# Altium schematic sheet Transformer_Powder.SchDoc
size A4
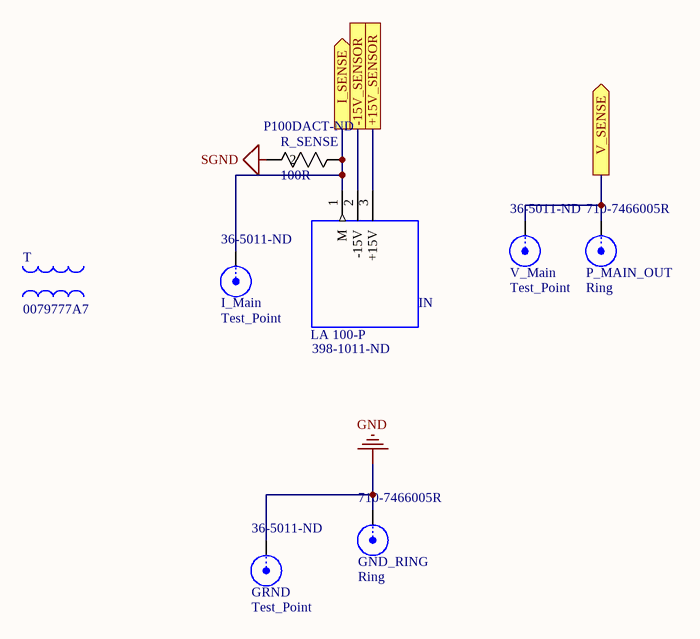
[diagram p0: Transformer_Powder.SchDoc]

## Parts
GND_RING  Ring  Supplier Part Number 1: 710-7466005R  [7466005R]
GRND  Test_Point  Supplier Part Number 1: 36-5011-ND  [5011]
I_Main  Test_Point  Supplier Part Number 1: 36-5011-ND  [5011]
LA_100-P  IN  Supplier Part Number 1: 398-1011-ND  [LA 100-P]
P_MAIN_OUT  Ring  Supplier Part Number 1: 710-7466005R  [7466005R]
R_SENSE  100R  Supplier Part Number 1: P100DACT-ND  [RES_ERA6A_0805]
T  0079777A7  [Fat_Man]
V_Main  Test_Point  Supplier Part Number 1: 36-5011-ND  [5011]

## Ports
+15V_SENSOR, -15V_SENSOR, I_SENSE (out), V_SENSE (out)

## Nets
GND: GND_RING.1(X) GRND.1(X)
SGND: R_SENSE.2
+15V_SENSOR: LA_100-P.3(+15V) ; port +15V_SENSOR
-15V_SENSOR: LA_100-P.2(-15V) ; port -15V_SENSOR
I_SENSE: I_Main.1(X) LA_100-P.1(M) R_SENSE.1 ; port I_SENSE
V_SENSE: P_MAIN_OUT.1(X) V_Main.1(X) ; port V_SENSE

## Library data of the parts
GND_RING P_MAIN_OUT = BNC: Ring Connector; Manufacturer: Wurth Electronics; Current Rating: 70A; Thread Size: M5; ComponentLink1URL: https://katalog.we-online.de/em/datasheet/7466003.pdf?src-supplier=Digi-Key; ComponentLink1Description: https://katalog.we-online.de/em/datasheet/7466003.pdf?src-supplier=Digi-Key; Supplier 1: Mouser; Manufacturer Part Number: 7466005R; Stock 1: 2328; Pricing 1: 1=2.37, 10=1.98, 25=1.98, 50=1.74, 100=1.58, 250=1.58 (USD); Mount: Surface Mount; Contact Plating: Tin; Contact Material: Brass; Termination: Power; ComponentLink2URL: https://katalog.we-online.de/em/datasheet/7466005R.pdf?src-supplier=Digi-Key; ComponentLink2Description: https://katalog.we-online.de/em/datasheet/7466005R.pdf?src-supplier=Digi-Key
GRND I_Main V_Main = BNC: Manufacturer: Keystone Electronics; Body Material: PBT; Gender: Female; Number of Ports: 1; Inside Diameter: 1.78mm; Hole Diameter: 1.6mm; Supplier 1: Digi-Key; Manufacturer Part Number: 5011; Stock 1: 84156; Pricing 1: 1=0.35, 25=0.308, 100=0.3015, 250=0.28304, 500=0.2523, 1000=0.1714, 2500=0.15296, 5000=0.1434, 10000=0.13384 (USD); Mount: PCB,Through Hole; Color: Black; Contact Material: Bronze; Contact Plating: Silver,Tin; Material: Nylon,Bronze,Silver; Housing Color: Black; Package Quantity: 100; Packaging: Bulk; Orientation: Straight; Length: 11.3mm; Lead Free: Lead Free; REACH SVHC: No SVHC; Flammability Rating: UL94 V-0; ComponentLink1URL: http://www.farnell.com/datasheets/1703983.pdf?src-supplier=Element14; ComponentLink1Description: http://www.farnell.com/datasheets/1703983.pdf?src-supplier=Element14; ComponentLink2URL: http://www.keyelco.com/product-pdf.cfm?p=1320&src-supplier=Digi-Key; ComponentLink2Description: http://www.keyelco.com/product-pdf.cfm?p=1320&src-supplier=Digi-Key; ComponentLink3URL: http://www.keyelco.com/userAssets/file/M60-2p60.pdf?src-supplier=Future+Electronics; ComponentLink3Description: http://www.keyelco.com/userAssets/file/M60-2p60.pdf?src-supplier=Future+Electronics; ComponentLink4URL: http://uk.rs-online.com/webdocs/1416/0900766b814167b6.pdf?src-supplier=RSComponents; ComponentLink4Description: http://uk.rs-online.com/webdocs/1416/0900766b814167b6.pdf?src-supplier=RSComponents
LA_100-P = LKSR_6-NP: Current Transducer LA series; Manufacturer: LEM; Manufacturer Part Number: LA100-P; Operating Supply Voltage: 15V; Response Time: 1us; Accuracy: 0.45%; Current Rating: 100A; Secondary Current: 50mA; Frequency: 200kHz; Number of Channels: 1; Max Supply Current: 10mA; Polarity: Bidirectional; Min Supply Voltage (DC): 12V; Linearity: 0.15%; Wire/Cable Diameter: 7mm; Supplier 1: Digi-Key; Stock 1: 1997; Pricing 1: 1=25.57, 5=24.402, 10=22.079, 25=20.336, 50=18.0118, 100=17.4307, 500=16.26864 (USD); Mount: Through Hole,PCB; Case/Package: 100; Min Operating Temperature: -40°C; Max Operating Temperature: 85°C; Package Quantity: 1; Packaging: Bulk; Max Supply Voltage (DC): 15V; Current Sensing: 100A; Height: 27.2mm; Width: 36.5mm; Lead Free: Lead Free; REACH SVHC: No SVHC; ComponentLink1URL: https://www.distrelec.biz/Web/Downloads/_t/ds/LA100P_eng_tds.pdf?mime=application%2Fpdf&src-supplier=Distrelec; ComponentLink1Description: https://www.distrelec.biz/Web/Downloads/_t/ds/LA100P_eng_tds.pdf?mime=application%2Fpdf&src-supplier=Distrelec; ComponentLink2URL: http://www.farnell.com/datasheets/1639874.pdf?src-supplier=Element14; ComponentLink2Description: http://www.farnell.com/datasheets/1639874.pdf?src-supplier=Element14; ComponentLink3URL: https://www.lem.com/sites/default/files/products_datasheets/la_100-p_e_.pdf?src-supplier=Digi-Key; ComponentLink3Description: https://www.lem.com/sites/default/files/products_datasheets/la_100-p_e_.pdf?src-supplier=Digi-Key; ComponentLink4URL: http://datasheet.iiic.cc/lem/LA100-P.pdf?src-supplier=IIIC; ComponentLink4Description: http://datasheet.iiic.cc/lem/LA100-P.pdf?src-supplier=IIIC
R_SENSE = ERA6AEB101V: No Description Available; Manufacturer Part Number: ERA-6AEB101V; Vendor: Panasonic; Built_By: EMA_UL_Team; Tolerance: 0.1%; Temperature Coefficient: 25ppm/°C; Power Rating: 125mW; Voltage Rating: 100V; Manufacturer_Part_Number: ERA6AEB101V; Copyright: Copyright (C) 2018 Accelerated Designs. All rights reserved; RefDes: RefDes; Type: DEV; Value: Value; Supplier 1: Digi-Key; Manufacturer: Panasonic; Stock 1: 138980; Pricing 1: 1=0.36, 10=0.302, 100=0.1182, 1000=0.04948, 2500=0.04536 (USD); Mount: Surface Mount; Case/Package: 0805; Number of Pins: 2; Contact Plating: Tin; Case Code (Imperial): 0805; Case Code (Metric): 2012; Min Operating Temperature: -55°C; Max Operating Temperature: 155°C; Resistance: 100R; Composition: Metal Film,Thin Film; Packaging: Tape and Reel; Package Quantity: 1; Termination: SMD/SMT; Number of Terminations: 2; Military Standard: Not; Max Power Dissipation: 125mW; Voltage Rating (DC): 100V; Features: Automotive AEC-Q200; Length: 2mm; Height: 0.5mm; Width: 1.25mm; Depth: 1.25mm; Radiation Hardening: No; REACH SVHC: No SVHC; Lead Free: Lead Free; ComponentLink1URL: https://www.alliedelec.com/m/d/b6b0537e86f421aa7f5975bb1d8f429a.pdf?src-supplier=Allied+Electronics; ComponentLink1Description: https://www.alliedelec.com/m/d/b6b0537e86f421aa7f5975bb1d8f429a.pdf?src-supplier=Allied+Electronics; ComponentLink2URL: http://www.farnell.com/datasheets/485442.pdf?src-supplier=Farnell; ComponentLink2Description: http://www.farnell.com/datasheets/485442.pdf?src-supplier=Farnell; ComponentLink3URL: http://www.farnell.com/datasheets/485442.pdf?src-supplier=Element14; ComponentLink3Description: http://www.farnell.com/datasheets/485442.pdf?src-supplier=Element14; ComponentLink4URL: http://industrial.panasonic.com/www-data/pdf/AOA0000/AOA0000CE26.pdf?src-supplier=Avnet+Europe; ComponentLink4Description: http://industrial.panasonic.com/www-data/pdf/AOA0000/AOA0000CE26.pdf?src-supplier=Avnet+Europe; ComponentLink5URL: http://www.mouser.com/ds/2/315/AOA0000CE26-32660.pdf?src-supplier=Mouser; ComponentLink5Description: http://www.mouser.com/ds/2/315/AOA0000CE26-32660.pdf?src-supplier=Mouser; ComponentLink6URL: https://www.distrelec.biz/Web/Downloads/_t/ds/ERA_eng_tds.pdf?mime=application%2Fpdf&src-supplier=Distrelec; ComponentLink6Description: https://www.distrelec.biz/Web/Downloads/_t/ds/ERA_eng_tds.pdf?mime=application%2Fpdf&src-supplier=Distrelec; ComponentLink7URL: http://industrial.panasonic.com/www-data/pdf/AOA0000/AOA0000CE26.pdf?src-supplier=Future+Electronics; ComponentLink7Description: http://industrial.panasonic.com/www-data/pdf/AOA0000/AOA0000CE26.pdf?src-supplier=Future+Electronics; ComponentLink8URL: http://industrial.panasonic.com/www-data/pdf/AOA0000/AOA0000CE26.pdf?src-supplier=Avnet; ComponentLink8Description: http://industrial.panasonic.com/www-data/pdf/AOA0000/AOA0000CE26.pdf?src-supplier=Avnet; ComponentLink9URL: http://uk.rs-online.com/webdocs/0bee/0900766b80beefcc.pdf?src-supplier=RSComponents; ComponentLink9Description: http://uk.rs-online.com/webdocs/0bee/0900766b80beefcc.pdf?src-supplier=RSComponents; ComponentLink10URL: https://produktinfo.conrad.com/datenblaetter/450000-474999/452698-da-01-en-WIDERSTAND_0805_ERA.pdf?src-supplier=Conrad; ComponentLink10Description: https://produktinfo.conrad.com/datenblaetter/450000-474999/452698-da-01-en-WIDERSTAND_0805_ERA.pdf?src-supplier=Conrad
T = Trans: Transformer; Manufacturer 1: Magnetics; Pricing 1: 16.66; Supplier 1: Magnetics; Manufacturer Part Number 1: 0079777A7